# Altium schematic sheet base_tiempo.SchDoc: Base de tiempo
size A4; Revision: 1
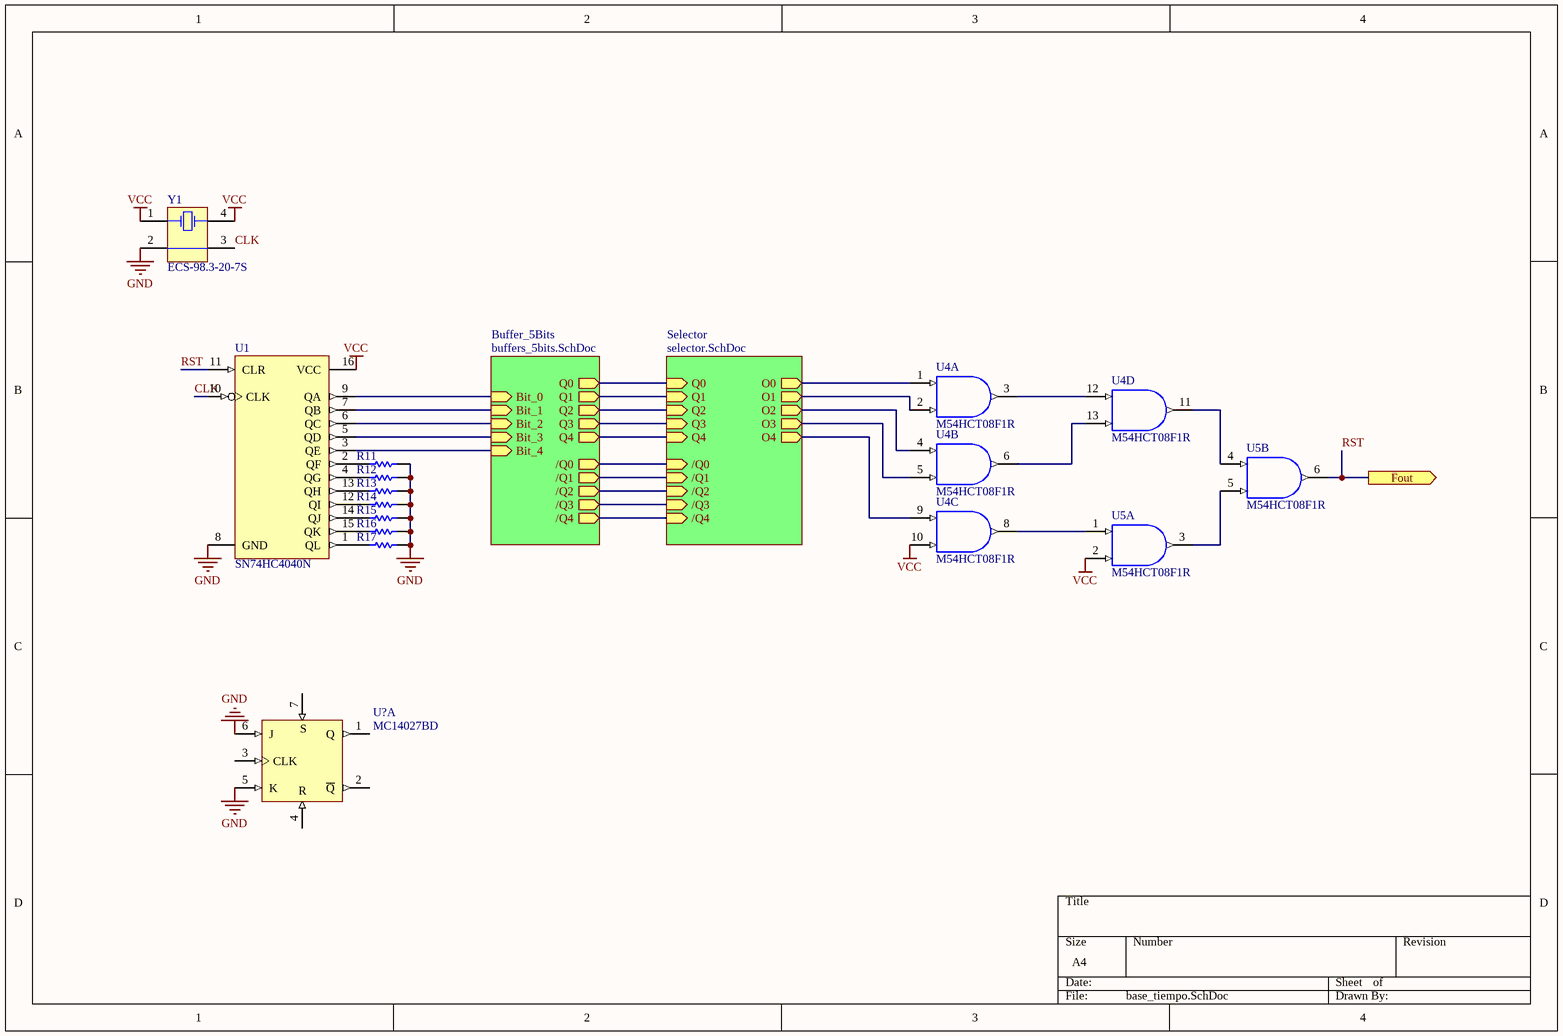
[diagram p0: base_tiempo.SchDoc]

## Parts
R11  Res Semi  [2012[0805]]  (value not drawn)
R12  Res Semi  [2012[0805]]  (value not drawn)
R13  Res Semi  [2012[0805]]  (value not drawn)
R14  Res Semi  [2012[0805]]  (value not drawn)
R15  Res Semi  [2012[0805]]  (value not drawn)
R16  Res Semi  [2012[0805]]  (value not drawn)
R17  Res Semi  [2012[0805]]  (value not drawn)
U1  SN74HC4040N  [N016]
U4  M54HCT08F1R  [CDIP14]  (parts A,B,C,D of 4)
U5  M54HCT08F1R  [CDIP14]  (parts A,B of 4)
U?  MC14027BD  [751B-05_N]  (part A of 2)
Y1  ECS-98.3-20-7S  [ECX-3S]

## Sub-sheets
Buffer_5Bits = buffers_5bits.SchDoc: Bit_0 (in), Bit_1 (in), Bit_2 (in), Bit_3 (in), Bit_4 (in), Q0 (out), Q1 (out), Q2 (out), Q3 (out), Q4 (out), /Q0 (out), /Q1 (out), /Q2 (out), /Q3 (out), /Q4 (out)
Selector = selector.SchDoc: Q0 (in), Q1 (in), Q2 (in), Q3 (in), Q4 (in), /Q0 (in), /Q1 (in), /Q2 (in), /Q3 (in), /Q4 (in), O0 (out), O1 (out), O2 (out), O3 (out), O4 (out)

## Ports
Fout (out)

## Nets
GND: R11.2 R12.2 R13.2 R14.2 R15.2 R16.2 R17.2 U1.8(GND) U4.7(GND) U5.7(GND) U?.5(K) U?.6(J) U?.8(GND) Y1.2(COM)
VCC: U1.16(VCC) U4.10(B) U4.14(VCC) U5.2(B) U5.14(VCC) Y1.1(OSC1) Y1.4(OSC2)
VDD: U?.16(VDD)
CLK: U1.10(CLK) Y1.3(COM)
RST: U1.11(CLR) U5.6(Y) ; port Fout
NetR11_1: R11.1 U1.2(QF)
NetR12_1: R12.1 U1.4(QG)
NetR13_1: R13.1 U1.13(QH)
NetR14_1: R14.1 U1.12(QI)
NetR15_1: R15.1 U1.14(QJ)
NetR16_1: R16.1 U1.15(QK)
NetR17_1: R17.1 U1.1(QL)
NetU1_3: U1.3(QE) ; sheet Buffer_5Bits/Bit_4
NetU1_5: U1.5(QD) ; sheet Buffer_5Bits/Bit_3
NetU1_6: U1.6(QC) ; sheet Buffer_5Bits/Bit_2
NetU1_7: U1.7(QB) ; sheet Buffer_5Bits/Bit_1
NetU1_9: U1.9(QA) ; sheet Buffer_5Bits/Bit_0
NetU4_1: U4.1(A) ; sheet Selector/O0
NetU4_2: U4.2(B) ; sheet Selector/O1
NetU4_3: U4.3(Y) U4.12(A)
NetU4_4: U4.4(A) ; sheet Selector/O2
NetU4_5: U4.5(B) ; sheet Selector/O3
NetU4_6: U4.6(Y) U4.13(B)
NetU4_8: U4.8(Y) U5.1(A)
NetU4_9: U4.9(A) ; sheet Selector/O4
NetU4_11: U4.11(Y) U5.4(A)
NetU5_3: U5.3(Y) U5.5(B)
(unnamed): sheet Buffer_5Bits/Q0, sheet Selector/Q0
(unnamed): sheet Buffer_5Bits/Q1, sheet Selector/Q1
(unnamed): sheet Buffer_5Bits/Q2, sheet Selector/Q2
(unnamed): sheet Buffer_5Bits/Q3, sheet Selector/Q3
(unnamed): sheet Buffer_5Bits/Q4, sheet Selector/Q4
(unnamed): sheet Buffer_5Bits//Q0, sheet Selector//Q0
(unnamed): sheet Buffer_5Bits//Q1, sheet Selector//Q1
(unnamed): sheet Buffer_5Bits//Q2, sheet Selector//Q2
(unnamed): sheet Buffer_5Bits//Q3, sheet Selector//Q3
(unnamed): sheet Buffer_5Bits//Q4, sheet Selector//Q4

Not connected (* = marked no-connect by the designer): U? 1(Q) 2(~{Q}) 3(CLK) 4(R) 7(S)

## Library data of the parts
R11-R17 = Res Semi: Semiconductor Resistor; Value: 1K; Published: 8-Jun-2000; LatestRevisionDate: 17-Jul-2002; LatestRevisionNote: Re-released for DXP Platform.; PackageReference: AXIAL-0.5; Publisher: Altium Limited
U1 = SN74HC4040N: 12-Bit Asynchronous Binary Counter; Published: 8-Jun-2000; LatestRevisionDate: 04-Mar-2005; LatestRevisionNote: Stylized 3D Model Added.; DatasheetVersion: May-1997; PackageVersion: Oct-1995; PackageReference: N016; Publisher: Altium Limited; PackageDescription: DIP; 16 Leads; Row Spacing 7.62 mm; Pitch 2.54 mm; Code_JEDEC: MS-001-BB; ComponentLink1Description: Manufacturer Link; ComponentLink1URL: http://www.ti.com/; ComponentLink2Description: Datasheet; ComponentLink2URL: http://www-s.ti.com/sc/ds/sn74hc4040.pdf
U4 U5 = M54HCT08F1R: Quad 2-Input AND Gate; Published: 8-Jun-2000; LatestRevisionDate: 06-Jun-2005; LatestRevisionNote: Stylized 3D Model Added.; DatasheetVersion: Feb-1993; PackageReference: CDIP14; Publisher: Altium Limited; PackageDescription: DIP; 14 Leads; Row Spacing 7.62 mm; Pitch 2.54 mm; ComponentLink1Description: Manufacturer Link; ComponentLink1URL: http://www.st.com/
U? = MC14027BD: Dual J-K Flip-Flop; Published: 15-Apr-2002; LatestRevisionDate: 13-Apr-2006; LatestRevisionNote: IPC-7351 Footprint Added.; DatasheetVersion: 1995; PackageVersion: Oct-1999; PackageReference: 751B-05; Publisher: Altium Limited; PackageDescription: 16-Pin Small Outline Integrated Circuit 1.27 mm Pitch; Code_JEDEC: MS-012-AC; Code_IPC: SOIC127P600-16; ComponentLink1Description: Manufacturer Link; ComponentLink1URL: http://www.onsemi.com/; ComponentLink2Description: Datasheet; ComponentLink2URL: http://www.onsemi.com/pub/Collateral/MC14027B-D.PDF
Y1 = ECS-98.3-20-7S: Crystal Oscillator; Published: 17-Jul-2002; DatasheetDocument: 18-Apr-2000; PackageReference: ECX-3S; Publisher: Altium Limited; ComponentLink1Description: Manufacturer Link; ComponentLink1URL: http://www.ecsxtal.com/; ComponentLink2Description: Datasheet; ComponentLink2URL: http://www.ecsxtal.com/pdf/ecx-3s.pdf